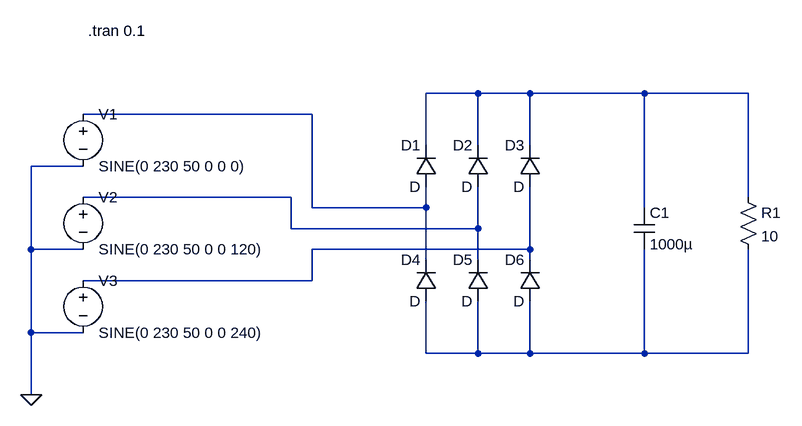
[diagram p0: schematic 3phase-rectifier.asc]
3phase-rectifier.asc, the LTspice schematic file:
Version 4
SHEET 1 948 680
WIRE 352 112 272 112
WIRE 432 112 352 112
WIRE 608 112 432 112
WIRE 768 112 608 112
WIRE 96 144 -256 144
WIRE 272 192 272 112
WIRE 352 192 352 112
WIRE 432 192 432 112
WIRE -256 224 -336 224
WIRE 64 272 -256 272
WIRE 768 272 768 112
WIRE 96 288 96 144
WIRE 272 288 272 256
WIRE 272 288 96 288
WIRE 608 288 608 112
WIRE 64 320 64 272
WIRE 352 320 352 256
WIRE 352 320 64 320
WIRE -336 352 -336 224
WIRE -256 352 -336 352
WIRE 432 352 432 256
WIRE 432 352 96 352
WIRE 272 368 272 288
WIRE 352 368 352 320
WIRE 432 368 432 352
WIRE 96 400 96 352
WIRE 96 400 -256 400
WIRE -336 480 -336 352
WIRE -256 480 -336 480
WIRE 272 512 272 432
WIRE 352 512 352 432
WIRE 352 512 272 512
WIRE 432 512 432 432
WIRE 432 512 352 512
WIRE 608 512 608 352
WIRE 608 512 432 512
WIRE 768 512 768 352
WIRE 768 512 608 512
WIRE -336 576 -336 480
FLAG -336 576 0
SYMBOL voltage -256 128 R0
SYMATTR InstName V1
SYMATTR Value SINE(0 230 50 0 0 0)
SYMATTR Value2 AC 230 0
SYMBOL voltage -256 256 R0
SYMATTR InstName V2
SYMATTR Value SINE(0 230 50 0 0 120)
SYMATTR Value2 AC 230 120
SYMBOL voltage -256 384 R0
SYMATTR InstName V3
SYMATTR Value SINE(0 230 50 0 0 240)
SYMATTR Value2 AC 230 240
SYMBOL diode 288 256 R180
WINDOW 0 24 64 Left 2
WINDOW 3 24 0 Left 2
SYMATTR InstName D1
SYMBOL diode 368 256 R180
WINDOW 0 24 64 Left 2
WINDOW 3 24 0 Left 2
SYMATTR InstName D2
SYMBOL diode 448 256 R180
WINDOW 0 24 64 Left 2
WINDOW 3 24 0 Left 2
SYMATTR InstName D3
SYMBOL diode 288 432 R180
WINDOW 0 24 64 Left 2
WINDOW 3 24 0 Left 2
SYMATTR InstName D4
SYMBOL diode 368 432 R180
WINDOW 0 24 64 Left 2
WINDOW 3 24 0 Left 2
SYMATTR InstName D5
SYMBOL diode 448 432 R180
WINDOW 0 24 64 Left 2
WINDOW 3 24 0 Left 2
SYMATTR InstName D6
SYMBOL cap 592 288 R0
SYMATTR InstName C1
SYMATTR Value 1000µ
SYMBOL res 752 256 R0
SYMATTR InstName R1
SYMATTR Value 10
TEXT -248 16 Left 2 !.tran 0.1

The netlist it stands for:
* 3phase-rectifier.asc
V1 N002 0 SINE(0 230 50 0 0 0) AC 230 0
V2 N003 0 SINE(0 230 50 0 0 120) AC 230 120
V3 N004 0 SINE(0 230 50 0 0 240) AC 230 240
D1 N002 N001 D
D2 N003 N001 D
D3 N004 N001 D
D4 N005 N002 D
D5 N005 N003 D
D6 N005 N004 D
C1 N001 N005 1000µ
R1 N001 N005 10
.model D D
.lib standard.dio
.tran 0.1
.backanno
.end